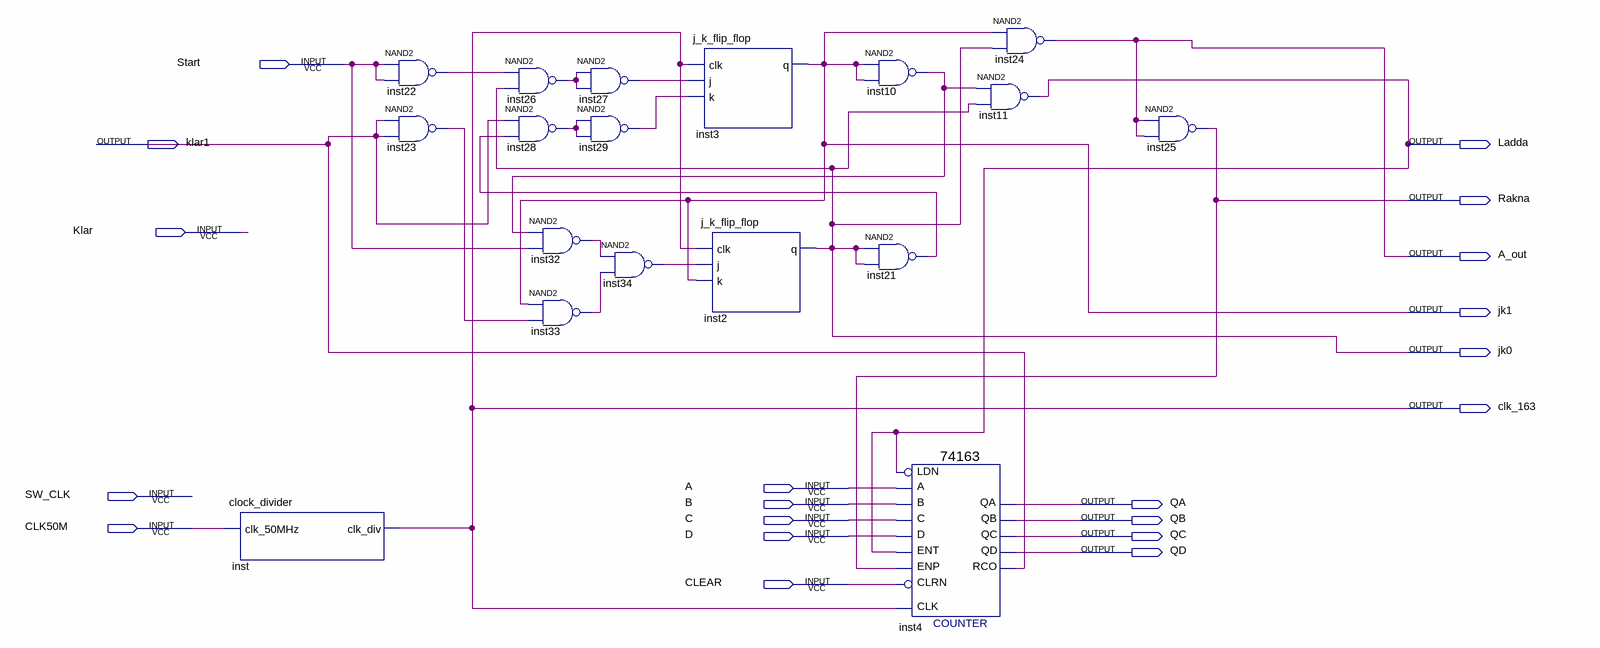
[diagram p0: schematic sheet]
// Quartus schematic uppgift4 (2).bdf as structural Verilog: 18 symbols, 20 pins
module \uppgift4_(2)  (
  input  Start,
  input  Klar,
  input  A,
  input  SW_CLK,
  input  B,
  input  C,
  input  CLK50M,
  input  D,
  input  CLEAR,
  output klar1,
  output Ladda,
  output Rakna,
  output A_out,
  output jk1,
  output jk0,
  output clk_163,
  output QA,
  output QB,
  output QC,
  output QD
);

  wire inst10_out, inst21_out, inst22_out, inst23_out, inst26_out, inst27_out, inst28_out, inst29_out,
       inst32_out, inst33_out, inst34_out;

  clock_divider inst (.clk_50MHz(CLK50M), .clk_div(clk_163));
  nand inst22 (inst22_out, Start, Start);
  nand inst23 (inst23_out, klar1, klar1);
  nand inst26 (inst26_out, inst22_out, jk0);
  nand inst28 (inst28_out, klar1, inst21_out);
  nand inst32 (inst32_out, inst10_out, Start);
  nand inst33 (inst33_out, jk1, inst23_out);
  nand inst27 (inst27_out, inst26_out, inst26_out);
  nand inst29 (inst29_out, inst28_out, inst28_out);
  nand inst34 (inst34_out, inst32_out, inst33_out);
  j_k_flip_flop inst3 (.clk(clk_163), .j(inst27_out), .k(inst29_out), .q(jk1));
  j_k_flip_flop inst2 (.clk(clk_163), .j(inst34_out), .k(jk1), .q(jk0));
  nand inst10 (inst10_out, jk1, jk1);
  nand inst21 (inst21_out, jk0, jk0);
  \74163  inst4 (
    .C(C), .B(B), .A(A), .ENT(Ladda), .D(D), .CLRN(CLEAR), .CLK(clk_163), .ENP(Rakna), .LDN(Ladda), .QA(QA),
    .QB(QB), .QC(QC), .QD(QD), .RCO(klar1));
  nand inst11 (Ladda, inst10_out, jk0);
  nand inst24 (A_out, jk1, jk0);
  nand inst25 (Rakna, A_out, A_out);
endmodule
